# EAGLE schematic pu alt crystal (EAGLE 7.6.0)
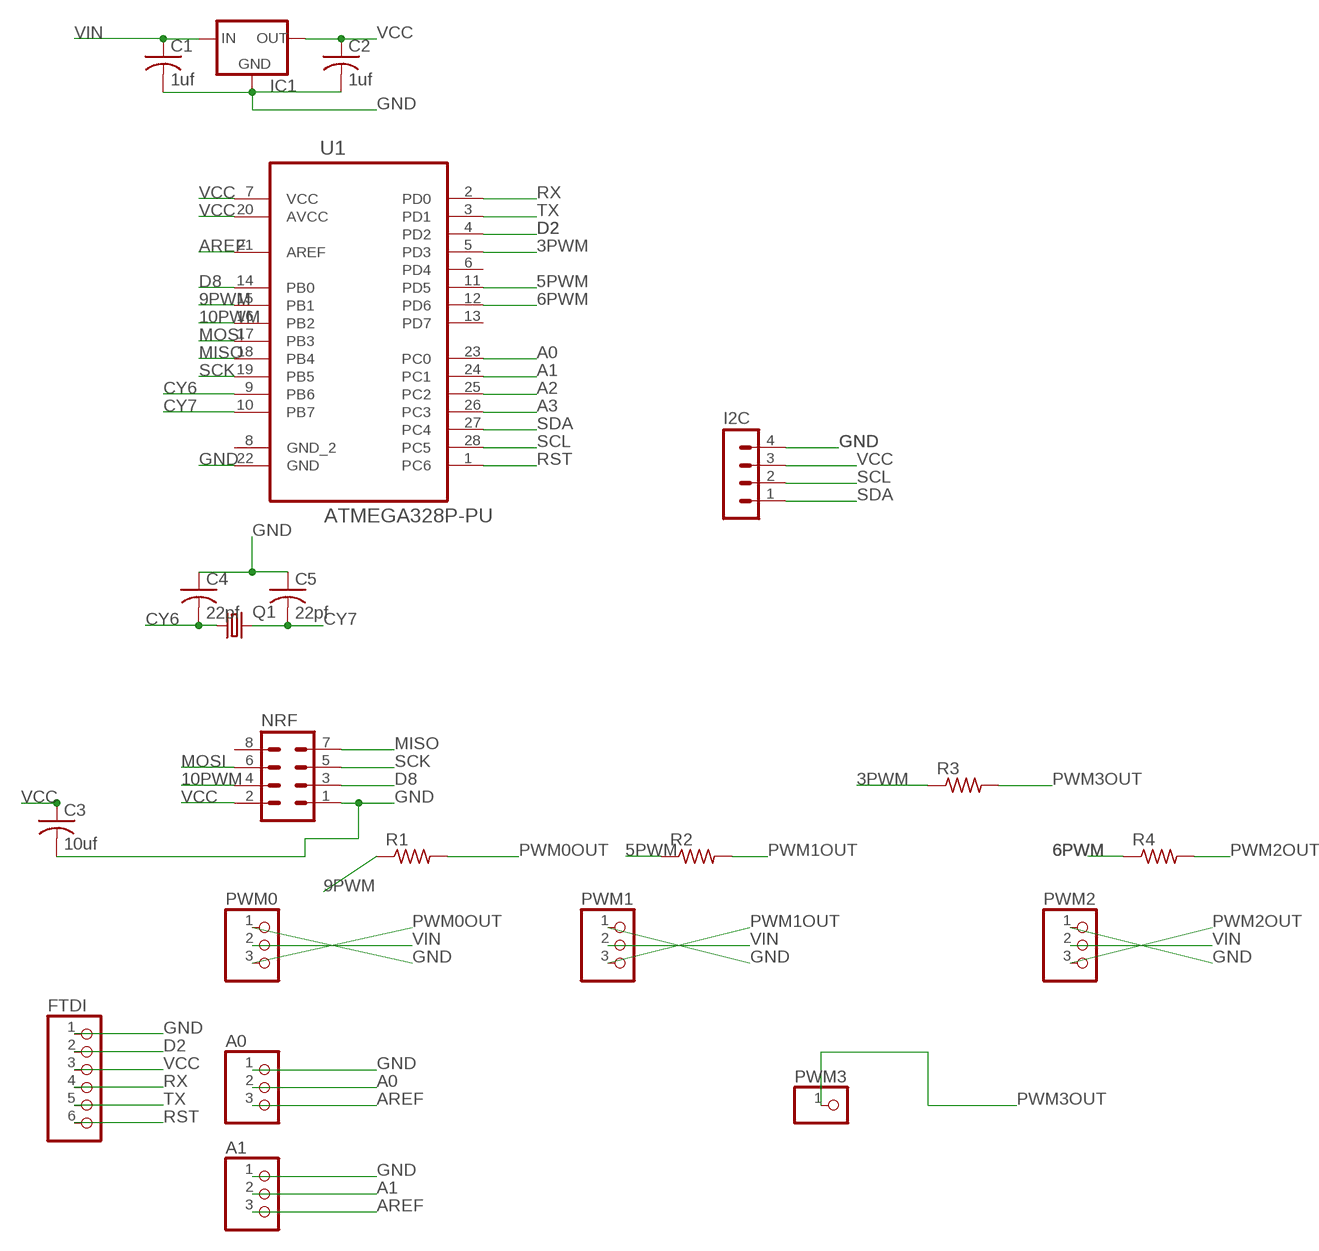
[diagram p0: schematic, sheet 1]

## Parts
A0  PINHD-1X3  [1X03]
A1  PINHD-1X3  [1X03]
C1  1uf  C-US025-025X050  [C025-025X050]
C2  1uf  C-US025-025X050  [C025-025X050]
C3  10uf  C-US025-025X050  [C025-025X050]
C4  22pf  C-US025-025X050  [C025-025X050]
C5  22pf  C-US025-025X050  [C025-025X050]
FTDI  PINHD-1X6CLEAN  [1X06-CLEAN]
I2C  MA04-1  [MA04-1]
IC1  MCP1700TRI  [TO92]
NRF  MA04-2  [MA04-2]
PWM0  PINHD-1X3  [1X03]
PWM1  PINHD-1X3  [1X03]
PWM2  PINHD-1X3  [1X03]
PWM3  PINHD-1X1CB  [1X01-CLEANBIG]
Q1  CRYSTALHC49U-V  [HC49U-V]
R1  R-US_0204/5  [0204/5]
R2  R-US_0204/5  [0204/5]
R3  R-US_0204/5  [0204/5]
R4  R-US_0204/5  [0204/5]
U1  ATMEGA328P-PU  [DIP254P762X457-28]

## Nets
3PWM: R3.1 U1.5(PD3)
5PWM: R2.1 U1.11(PD5)
6PWM: R4.1 U1.12(PD6)
9PWM: R1.1 U1.15(PB1)
10PWM: NRF.4 U1.16(PB2)
A0: A0.2 U1.23(PC0)
A1: A1.2 U1.24(PC1)
A2: U1.25(PC2)
A3: U1.26(PC3)
AREF: A0.3 A1.3 U1.21(AREF)
CY6: C4.2 Q1.1 U1.9(PB6)
CY7: C5.2 Q1.2 U1.10(PB7)
D2: FTDI.2 U1.4(PD2)
D8: NRF.3 U1.14(PB0)
GND: A0.1 A1.1 C1.2 C2.2 C3.2 C4.1 C5.1 FTDI.1 I2C.4 IC1.1(GND) NRF.1 PWM0.1 PWM1.1 PWM2.1 U1.22(GND)
MISO: NRF.7 U1.18(PB4)
MOSI: NRF.6 U1.17(PB3)
PWM0OUT: PWM0.3 R1.2
PWM1OUT: PWM1.3 R2.2
PWM2OUT: PWM2.3 R4.2
PWM3OUT: PWM3.1 R3.2
RST: FTDI.6 U1.1(PC6)
RX: FTDI.4 U1.2(PD0)
SCK: NRF.5 U1.19(PB5)
SCL: I2C.2 U1.28(PC5)
SDA: I2C.1 U1.27(PC4)
TX: FTDI.5 U1.3(PD1)
VCC: C2.1 C3.1 FTDI.3 I2C.3 IC1.3(OUT) NRF.2 U1.7(VCC) U1.20(AVCC)
VIN: C1.1 IC1.2(IN) PWM0.2 PWM1.2 PWM2.2
Unconnected: NRF.8 U1.6(PD4) U1.8(GND_2) U1.13(PD7)

## Library data of the parts
A0 A1 PWM0 PWM1 PWM2 = adafruit:PINHD-1X3: PIN HEADER
C1-C5 = adafruit:C-US: CAPACITOR, American symbol
FTDI = adafruit:PINHD-1X6: PIN HEADER
I2C = con-lstb:MA04-1: PIN HEADER; OC_FARNELL: unknown; OC_NEWARK: unknown
IC1 = adafruit:MCP1700: VOLTAGE REGULATOR
NRF = con-lstb:MA04-2: PIN HEADER; OC_FARNELL: unknown; OC_NEWARK: unknown
PWM3 = adafruit:PINHD-1X1: Pin header 1x1 for 0.1" spacing With round pins
Q1 = crystal:CRYSTAL: CRYSTAL; OC_FARNELL: 1666969; OC_NEWARK: unknown
R1-R4 = resistor:R-US_: RESISTOR, American symbol
U1 = Atmel_By_element14_Batch_1-00:ATMEGA328P-PU: 8-bit Microcontroller with In-System Programmable Flash; MPN: ATMEGA328P-PU; OC_FARNELL: 1715487; OC_NEWARK: 15R0268; PACKAGE: PDIP-28; SUPPLIER: Atmel